# Altium schematic sheet Power.SchDoc
size A4
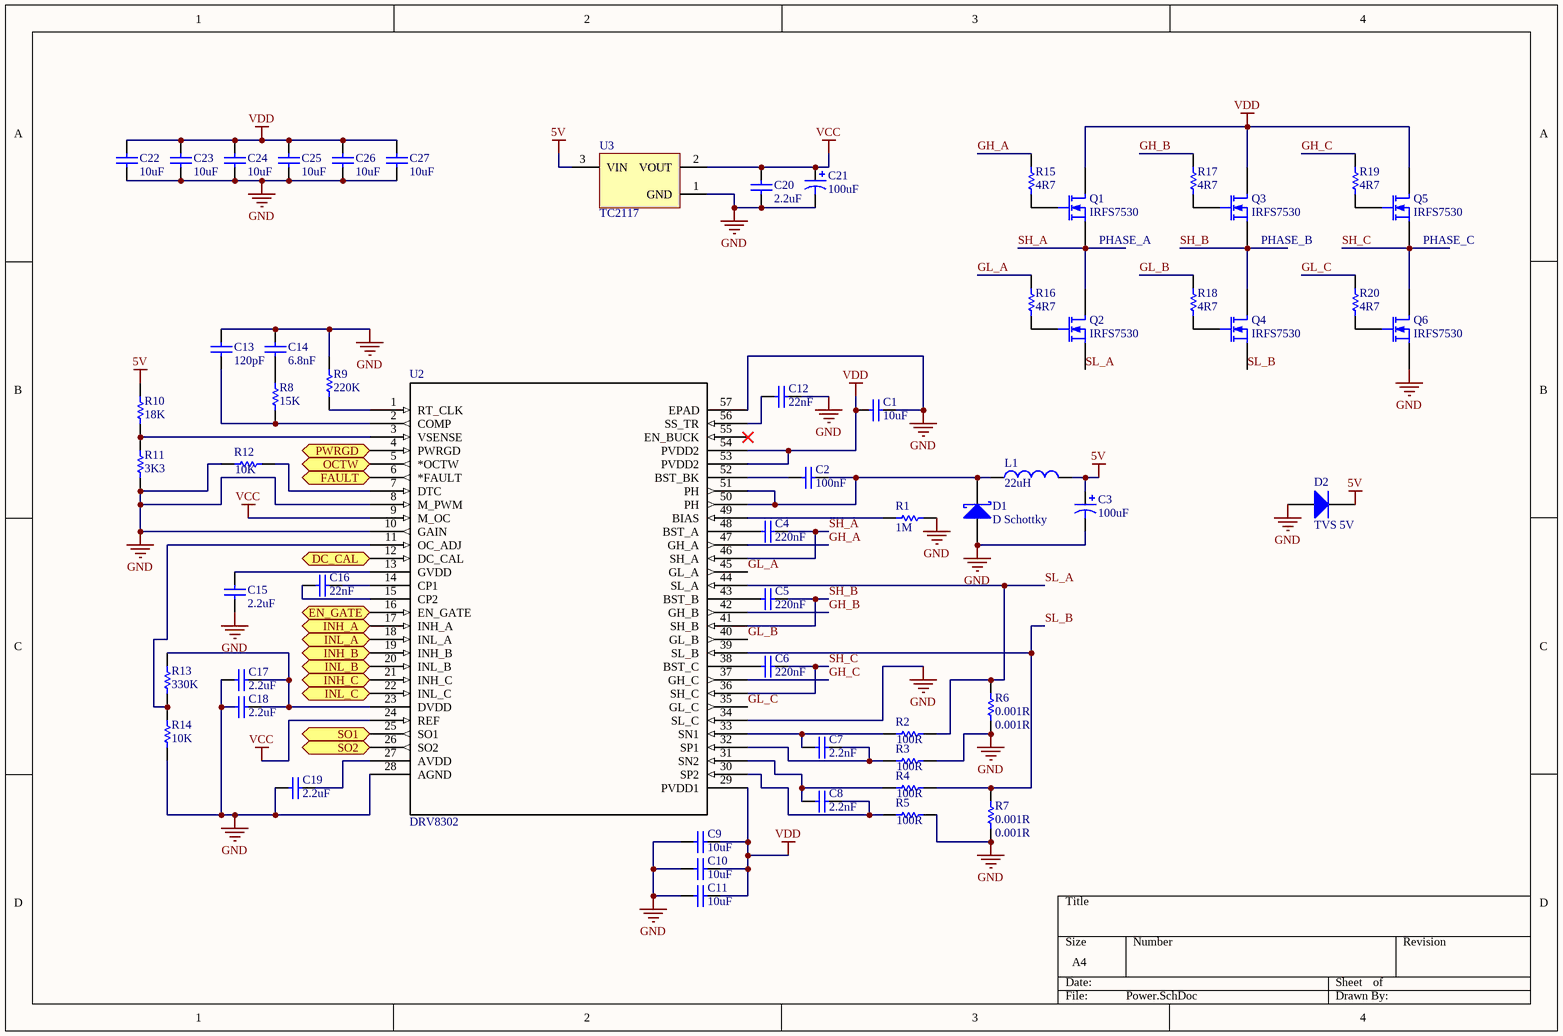
[diagram p0: Power.SchDoc]

## Parts
C1  10uF  [CAPC1206(3216)190_M]
C2  100nF  [CAPC0603(1608)100_N]
C3  100uF  [AVX-CAPC7343_V]
C4  220nF  [CAPC0805(2012)145_M]
C5  220nF  [CAPC0805(2012)145_M]
C6  220nF  [CAPC0805(2012)145_M]
C7  2.2nF  [CAPC0603(1608)100_N]
C8  2.2nF  [CAPC0603(1608)100_N]
C9  10uF  [CAPC1206(3216)190_M]
C10  10uF  [CAPC1206(3216)190_M]
C11  10uF  [CAPC1206(3216)190_M]
C12  22nF  [CAPC0603(1608)100_N]
C13  120pF  [CAPC0603(1608)100_N]
C14  6.8nF  [CAPC0603(1608)100_N]
C15  2.2uF  [CAPC0805(2012)145_N]
C16  22nF  [CAPC0603(1608)100_N]
C17  2.2uF  [CAPC0603(1608)55_N]
C18  2.2uF  [CAPC0603(1608)55_N]
C19  2.2uF  [CAPC0805(2012)145_N]
C20  2.2uF  [CAPC0603(1608)55_N]
C21  100uF  [AVX-CAPC7343_V]
C22  10uF  [CAPC1206(3216)190_M]
C23  10uF  [CAPC1206(3216)190_M]
C24  10uF  [CAPC1206(3216)190_M]
C25  10uF  [CAPC1206(3216)190_M]
C26  10uF  [CAPC1206(3216)190_M]
C27  10uF  [CAPC1206(3216)190_M]
D1  D Schottky  [SMB]
D2  TVS 5V  [VISH-DO-214AC-2_N]
L1  value 22uH  [SDR0805-180ML]  (hidden comment: SDR0805-180ML)
Q1  IRFS7530  [DPAK127P1525X483-7N]
Q2  IRFS7530  [DPAK127P1525X483-7N]
Q3  IRFS7530  [DPAK127P1525X483-7N]
Q4  IRFS7530  [DPAK127P1525X483-7N]
Q5  IRFS7530  [DPAK127P1525X483-7N]
Q6  IRFS7530  [DPAK127P1525X483-7N]
R1  1M  [RESC0603(1608)_N]
R2  100R  [RESC0603(1608)_N]
R3  100R  [RESC0603(1608)_N]
R4  100R  [RESC0603(1608)_N]
R5  100R  [RESC0603(1608)_N]
R6  0.001R  [Shunt]
R7  0.001R  [Shunt]
R8  15K  [RESC0603(1608)_N]
R9  220K  [RESC0603(1608)_N]
R10  18K  [RESC0603(1608)_N]
R11  3K3  [RESC0603(1608)_N]
R12  10K  [RESC0603(1608)_N]
R13  330K  [RESC0603(1608)_N]
R14  10K  [RESC0603(1608)_N]
R15  4R7  [RESC0603(1608)_N]
R16  4R7  [RESC0603(1608)_N]
R17  4R7  [RESC0603(1608)_M]
R18  4R7  [RESC0603(1608)_N]
R19  4R7  [RESC0603(1608)_N]
R20  4R7  [RESC0603(1608)_N]
U2  DRV8302  [DCA56_6P35X3P61]
U3  TC2117  [SOT-223-DB3_M]

## Ports
DC_CAL (in), EN_GATE (in), FAULT (out), INH_A (in), INH_B (in), INH_C (in), INL_A (in), INL_B (in), INL_C (in), OCTW (out), PWRGD (out), SO1 (out), SO2 (out)

## Nets
5V: C3.1 D2.1(K) L1.2 R10.1 U3.3(VIN)
GND: C1.2 C3.2 C9.1 C10.1 C11.1 C12.2 C13.1 C14.1 C15.2 C17.1 C18.1 C19.1 C20.2 C21.2 C22.1 C23.1 C24.1 C25.1 C26.1 C27.1 D1.1(A) D2.2(A) Q6.3(S) R1.2 R3.2 R5.2 R6.1 R7.1 R9.1 R11.2 R12.1 R14.2 U2.8(M_PWM) U2.10(GAIN) U2.28(AGND) U2.34(SL_C) U2.57(EPAD) U3.1(GND)
VCC: C20.1 C21.1 U2.9(M_OC) U2.24(REF) U3.2(VOUT)
VDD: C1.1 C9.2 C10.2 C11.2 C22.2 C23.2 C24.2 C25.2 C26.2 C27.2 Q1.1(D) Q3.1(D) Q5.1(D) U2.29(PVDD1) U2.53(PVDD2) U2.54(PVDD2)
DC_CAL: U2.12(DC_CAL) ; port DC_CAL
EN_GATE: U2.16(EN_GATE) ; port EN_GATE
FAULT: U2.6(*FAULT) ; port FAULT
GH_A: R15.2 U2.47(GH_A)
GH_B: R17.2 U2.42(GH_B)
GH_C: R19.2 U2.37(GH_C)
GL_A: R16.2 U2.45(GL_A)
GL_B: R18.2 U2.40(GL_B)
GL_C: R20.2 U2.35(GL_C)
INH_A: U2.17(INH_A) ; port INH_A
INH_B: U2.19(INH_B) ; port INH_B
INH_C: U2.21(INH_C) ; port INH_C
INL_A: U2.18(INL_A) ; port INL_A
INL_B: U2.20(INL_B) ; port INL_B
INL_C: U2.22(INL_C) ; port INL_C
OCTW: U2.5(*OCTW) ; port OCTW
PWRGD: U2.4(PWRGD) ; port PWRGD
SH_A: C4.2 Q1.3(S) Q2.1(D) U2.46(SH_A)
SH_B: C5.2 Q3.3(S) Q4.1(D) U2.41(SH_B)
SH_C: C6.2 Q5.3(S) Q6.1(D) U2.36(SH_C)
SL_A: Q2.3(S) R2.2 R6.2 U2.44(SL_A)
SL_B: Q4.3(S) R4.2 R7.2 U2.39(SL_B)
SO1: U2.25(SO1) ; port SO1
SO2: U2.26(SO2) ; port SO2
NetC2_1: C2.1 U2.52(BST_BK)
NetC2_2: C2.2 D1.2(K) L1.1 U2.50(PH) U2.51(PH)
NetC4_1: C4.1 U2.48(BST_A)
NetC5_1: C5.1 U2.43(BST_B)
NetC6_1: C6.1 U2.38(BST_C)
NetC7_1: C7.1 R2.1 U2.33(SN1)
NetC7_2: C7.2 R3.1 U2.32(SP1)
NetC8_1: C8.1 R4.1 U2.31(SN2)
NetC8_2: C8.2 R5.1 U2.30(SP2)
NetC12_1: C12.1 U2.56(SS_TR)
NetC13_2: C13.2 R8.2 U2.2(COMP)
NetC14_2: C14.2 R8.1
NetC15_1: C15.1 U2.13(GVDD)
NetC16_1: C16.1 U2.15(CP2)
NetC16_2: C16.2 U2.14(CP1)
NetC17_2: C17.2 C18.2 R13.1 U2.23(DVDD)
NetC19_2: C19.2 U2.27(AVDD)
NetQ1_2: Q1.2(G) R15.1
NetQ2_2: Q2.2(G) R16.1
NetQ3_2: Q3.2(G) R17.1
NetQ4_2: Q4.2(G) R18.1
NetQ5_2: Q5.2(G) R19.1
NetQ6_2: Q6.2(G) R20.1
NetR1_1: R1.1 U2.49(BIAS)
NetR9_2: R9.2 U2.1(RT_CLK)
NetR10_2: R10.2 R11.1 U2.3(VSENSE)
NetR12_2: R12.2 U2.7(DTC)
NetR13_2: R13.2 R14.1 U2.11(OC_ADJ)

Not connected (* = marked no-connect by the designer): U2 55(EN_BUCK)*

## Notes on the sheet
- (near Q1) PHASE_A
- (near Q3) PHASE_B
- (near Q5) PHASE_C

## Library data of the parts
C1 C9-C11 C22-C27 = CMP-1037-04982-1: CAP 10uF 50V Â±10% 1206 (3216 Metric) Thickness 1.9mm SMD; Case-EIA: 1206; Case-Metric: 3216; Technology: SMT; Tolerance: Â±10%; Max Thickness: 1.9 mm; Value: 10uF; Rated Voltage: 50 V
C2 = CMP-1035-02591-1: CAP 100nF 50V Â±5% 0603 (1608 Metric) Thickness 1mm SMD; Case-Metric: 1608; Case-EIA: 0603; Rated Voltage: 50 V; Max Thickness: 1 mm; Tolerance: Â±5%; Technology: SMT; Value: 100nF
C3 C21 = CMP-0279-00002-1: Capacitor, Tantalum, 220uF 10% 10V MCCT-D (7343-31); PartNumber: TAJD227K010R; Manufacturer: AVX; Polarity: Polarized; ComponentLink2URL: http://www.avx.com/docs/Catalogs/taj.pdf; PackageReference: CAPC7343; ComponentLink2Description: Datasheet; ComponentLink1URL: http://www.avx.com/; Mounting Technology: Surface Mount; Technology: Tantalum; Tolerance: 10%; Capacitance: 220uF; Rated Voltage: 10V; PackageDescription: 2-Pin SMT Capacitor, 7.3 x 4.3 mm Body; ComponentLink1Description: Manufacturer URL; DatasheetVersion: Jul-13
C4-C6 = CMP-1036-04540-1: CAP 220nF 25V Â±5% 0805 (2012 Metric) Thickness 1.45mm SMD; Case-EIA: 0805; Case-Metric: 2012; Technology: SMT; Max Thickness: 1.45 mm; Tolerance: Â±5%; Rated Voltage: 25 V; Value: 220nF
C7 C8 = CMP-1035-02036-1: CAP 2.2nF 50V Â±1% 0603 (1608 Metric) Thickness 1mm SMD; Case-EIA: 0603; Case-Metric: 1608; Max Thickness: 1 mm; Tolerance: Â±1%; Technology: SMT; Value: 2.2nF; Rated Voltage: 50 V
C12 C16 = CMP-1035-02425-1: CAP 22nF 50V Â±5% 0603 (1608 Metric) Thickness 1mm SMD; Case-EIA: 0603; Case-Metric: 1608; Max Thickness: 1 mm; Technology: SMT; Value: 22nF; Tolerance: Â±5%; Rated Voltage: 50 V
C13 = CMP-1035-01317-1: CAP 120pF 50V Â±1% 0603 (1608 Metric) Thickness 1mm SMD; Case-EIA: 0603; Case-Metric: 1608; Technology: SMT; Value: 120pF; Max Thickness: 1 mm; Rated Voltage: 50 V; Tolerance: Â±1%
C14 = CMP-1035-02266-1: CAP 6.8nF 50V Â±1% 0603 (1608 Metric) Thickness 1mm SMD; Case-Metric: 1608; Case-EIA: 0603; Tolerance: Â±1%; Value: 6.8nF; Technology: SMT; Max Thickness: 1 mm; Rated Voltage: 50 V
C15 C19 = CMP-1036-04830-1: CAP 2.2uF 16V Â±5% 0805 (2012 Metric) Thickness 1.45mm SMD; Case-EIA: 0805; Case-Metric: 2012; Rated Voltage: 16 V; Technology: SMT; Value: 2.2uF; Max Thickness: 1.45 mm; Tolerance: Â±5%
C17 C18 C20 = CMP-1035-02762-1: CAP 2.2uF 16V Â±10% 0603 (1608 Metric) Thickness 0.55mm SMD; Case-EIA: 0603; Case-Metric: 1608; Max Thickness: 0.55 mm; Technology: SMT; Value: 2.2uF; Rated Voltage: 16 V; Tolerance: Â±10%
D1 = D Schottky: Schottky Diode; Published: 8-Jun-2000; LatestRevisionDate: 17-Jul-2002; LatestRevisionNote: Re-released for DXP Platform.; PackageReference: SMB; Publisher: Altium Limited; PackageDescription: DO-214-AA/SMB; 2 C-Bend Leads; Body 5.3 x 3.6 mm, inc. leads (LxW); Code_JEDEC: DO-214-AA
D2 = CMP-0548-00235-1: Transient Voltage Suppressor, 6.40 to 231 V, 5 V Stand-off Voltage, Uni-Directional, -55 to 155 degC, 2-pin DO-214AC, Pb-Free, Tape and Reel; PartNumber: SMAJ5.0A-E3/61; Manufacturer: Vishay Semiconductor; ID (uA): 800; IFSM: 40 A; VBR Uni-Directional (V): 6.4 to 231; PPPM (W): 400, 300; VWM (V): 5; PackageDescription: 2-Pin DO-214AC (SMA), Body 4.245 x 2.665 mm; Mounting Technology: Surface Mount; ComponentLink3Description: Package Specification; ComponentLink1URL: http://www.vishay.com/; Operating Junction and Storage Temperature Range: -55 to 150 degC; PackageReference: DO-214AC-2; ComponentLink2URL: http://www.vishay.com/docs/88390/smaj50a.pdf; Packing: Tape and Reel; RoHS: TRUE; DatasheetVersion: 12/8/2013; ComponentLink3URL: http://www.vishay.com/docs/88390/smaj50a.pdf; ComponentLink1Description: Manufacturer URL; ComponentLink2Description: Datasheet
L1 = SDR0805-180ML: Inductor; Code_IEC: 1005; Published: 8-Jun-2000; LatestRevisionDate: 29-May-2009; LatestRevisionNote: IPC-7351 Footprint Added.; PackageReference: 0402-A; Publisher: Altium Limited; PackageDescription: Chip Inductor; Code_JEITA: 0402
Q1-Q6 = IRFS7530: N-Channel MOSFET; pin to pad: 1>8 2>1 3>2+3+5+6+7; Published: 8-Jun-2000; LatestRevisionDate: 17-Jul-2002; LatestRevisionNote: Re-released for DXP Platform.; PackageVersion: 1995/1996; PackageReference: E3; Publisher: Altium Limited; PackageDescription: TO, Flat Index; 3 In-Line, Axial Leads; Body Dia. 4.6mm; Lead Dia. 0.5 mm (max)
R1 = CMP-1012-00146-1: 1M 0.1W 5% 0603 (1608 Metric)  SMD; Case-EIA: 0603; Value: 1000000.00 Ohm; Case-Metric: 1608; Technology: SMT; Power: 0.1 W; Tolerance: 5 %
R2-R5 = CMP-1012-00050-1: 100R 0.1W 5% 0603 (1608 Metric)  SMD; Case-EIA: 0603; Value: 100.00 Ohm; Case-Metric: 1608; Tolerance: 5 %; Technology: SMT; Power: 0.1 W
R6 R7 = Shunt: Resistor; Published: 8-Jun-2000; LatestRevisionDate: 17-Jul-2002; LatestRevisionNote: Re-released for DXP Platform.; PackageReference: AXIAL-0.3; Publisher: Altium Limited; PackageDescription: Axial Device, Thru-Hole; 2 Leads; 0.3 in Pin Spacing; Value: 0.001R
R8 = CMP-1012-00102-1: 15K 0.1W 5% 0603 (1608 Metric)  SMD; Value: 15000.00 Ohm; Case-Metric: 1608; Case-EIA: 0603; Power: 0.1 W; Technology: SMT; Tolerance: 5 %
R9 = CMP-1012-00130-1: 220K 0.1W 5% 0603 (1608 Metric)  SMD; Case-Metric: 1608; Case-EIA: 0603; Value: 220000.00 Ohm; Technology: SMT; Tolerance: 5 %; Power: 0.1 W
R10 = CMP-1012-00104-1: 18K 0.1W 5% 0603 (1608 Metric)  SMD; Case-Metric: 1608; Case-EIA: 0603; Value: 18000.00 Ohm; Technology: SMT; Power: 0.1 W; Tolerance: 5 %
R11 = CMP-1012-00086-1: 3K3 0.1W 5% 0603 (1608 Metric)  SMD; Case-EIA: 0603; Value: 3300.00 Ohm; Case-Metric: 1608; Technology: SMT; Tolerance: 5 %; Power: 0.1 W
R12 R14 = CMP-1012-00098-1: 10K 0.1W 5% 0603 (1608 Metric)  SMD; Case-EIA: 0603; Value: 10000.00 Ohm; Case-Metric: 1608; Technology: SMT; Tolerance: 5 %; Power: 0.1 W
R13 = CMP-1012-00134-1: 330K 0.1W 5% 0603 (1608 Metric)  SMD; Case-Metric: 1608; Value: 330000.00 Ohm; Case-EIA: 0603; Power: 0.1 W; Tolerance: 5 %; Technology: SMT
R15-R20 = CMP-1012-00018-1: 4R7 0.1W 5% 0603 (1608 Metric)  SMD; Value: 4.70 Ohm; Case-EIA: 0603; Case-Metric: 1608; Power: 0.1 W; Tolerance: 5 %; Technology: SMT
U2 = DRV8302_DCA_56: Imported; Manufacturer: Texas Instruments; INDUSTRY_STD_PKG_TYPE: HTSSOP; FAMILY_NAME: 3-PHASE BRUSHLESS PRE-DRIVER; PIN_COUNT: 56; PACKAGE_DESIGNATOR: DCA; Datasheet URL: http://www.ti.com/lit/gpn/DRV8302; GENERIC_PART_NUMBER: DRV8302; Vendor: Texas Instruments; Manufacturer_Part_Number: drv8302_dca_56; RefDes: RefDes; Type: DEV; Value: Value
U3 = PM-LINEREG-TC2117-IL4: pin to pad: 2>2+4